# EasyEDA Pro project C51课程设计.eprj

# Schematic C51课程设计原理图
Create Date: 2022-09-08; Page Name: P1; Project Name: C51课程设计; Schematic Name: C51课程设计原理图; Update Date: 2022-09-14; Company: 亿航创客
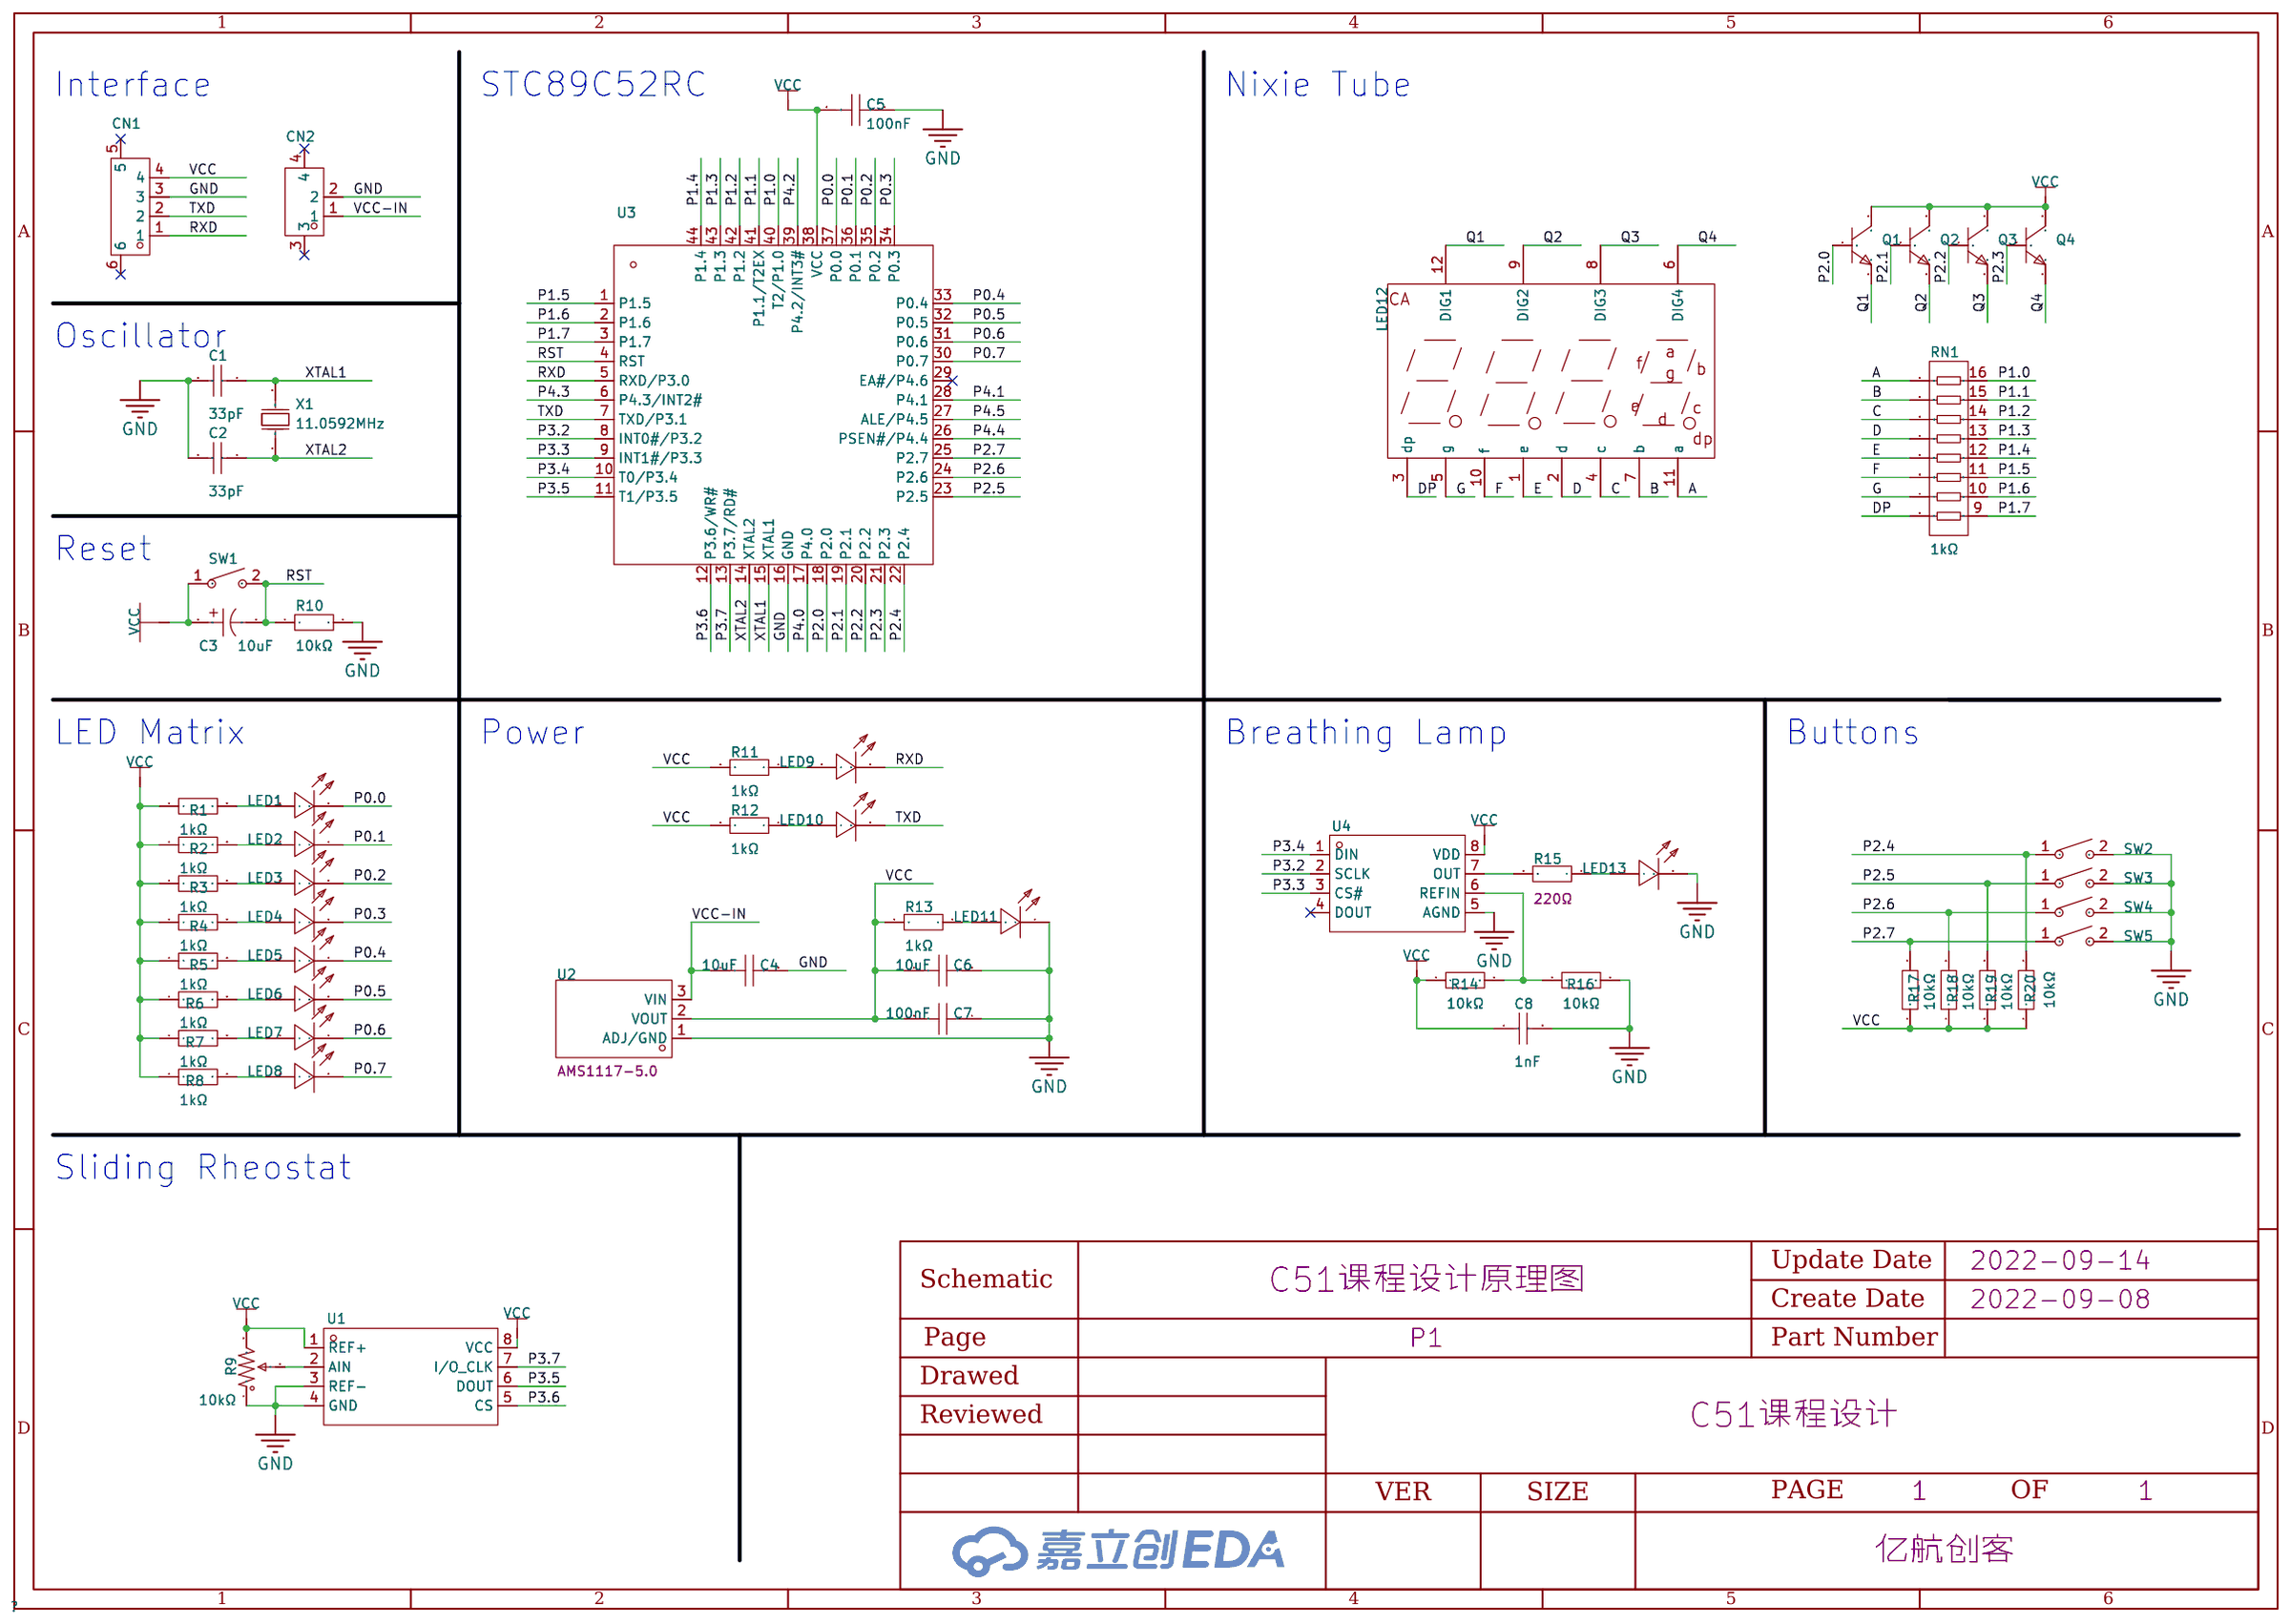
[diagram p0: schematic sheet]

## Parts
C1  33pF  [C0402]
C2  33pF  [C0402]
C3  10uF  [CAP-SMD_L2.0-W1.3-FD]
C4  10uF  [C0402]
C5  100nF  [C0402]
C6  10uF  [C0402]
C7  100nF  [C0402]
C8  1nF  [C0402]
CN1  -  [CONN-SMD_4P-P1.00_HDGC_HDGC1002WR-S-4P]
CN2  -  [CONN-SMD_HC-1.0-2PWT]
LED1  -  [LED0402-RD]
LED2  -  [LED0402-RD]
LED3  -  [LED0402-RD]
LED4  -  [LED0402-RD]
LED5  -  [LED0402-RD]
LED6  -  [LED0402-RD]
LED7  -  [LED0402-RD]
LED8  -  [LED0402-RD]
LED9  -  [LED0402-RD]
LED10  -  [LED0402-RD]
LED11  -  [LED0402-RD]
LED12  FJ2481BH  [LED-SEG-TH_FJ2481BH]
LED13  -  [LED0402-RD]
Q1  SS8050W Y1  [SOT-323-3_L2.1-W1.3-P1.30-LS2.3-BR]
Q2  SS8050W Y1  [SOT-323-3_L2.1-W1.3-P1.30-LS2.3-BR]
Q3  SS8050W Y1  [SOT-323-3_L2.1-W1.3-P1.30-LS2.3-BR]
Q4  SS8050W Y1  [SOT-323-3_L2.1-W1.3-P1.30-LS2.3-BR]
R1  1kΩ  [R0402]
R2  1kΩ  [R0402]
R3  1kΩ  [R0402]
R4  1kΩ  [R0402]
R5  1kΩ  [R0402]
R6  1kΩ  [R0402]
R7  1kΩ  [R0402]
R8  1kΩ  [R0402]
R9  10kΩ  [RES-ADJ-TH_3362P]
R10  10kΩ  [R0402]
R11  1kΩ  [R0402]
R12  1kΩ  [R0402]
R13  1kΩ  [R0402]
R14  10kΩ  [R0402]
R15  0402WGF2200TCE  [R0402]
R16  10kΩ  [R0402]
R17  10kΩ  [R0402]
R18  10kΩ  [R0402]
R19  10kΩ  [R0402]
R20  10kΩ  [R0402]
RN1  1kΩ  [RES-ARRAY-SMD_0603-16P-L4.0-W1.6-BL]
SW1  -  [SW-SMD_ST-1185S]
SW2  -  [SW-SMD_ST-1185S]
SW3  -  [SW-SMD_ST-1185S]
SW4  -  [SW-SMD_ST-1185S]
SW5  -  [SW-SMD_ST-1185S]
U1  XL549  [SOP-8_L5.0-W4.0-P1.27-LS6.0-BL]
U2  -  [SOT-89-3_L4.5-W2.5-P1.50-LS4.2-BR]
U3  STC89C52RC-40I  [LQFP-44_L10.0-W10.0-P0.80-LS12.0-BL]
U4  HGC5615CM/TR  [SOP-8_L4.9-W3.9-P1.27-LS6.0-BL-1]
X1  11.0592MHz  [OSC-SMD_L5.0-W3.2]

## Library data of the parts
C1 C2 = CC0402JRNPO9BN330: 容值:33pF;精度:±5%;额定电压:50V;材质(温度系数):NP0;; LCSC Part Name: 33pF ±5% 50V; Supplier Part: C1562; Manufacturer: YAGEO(国巨); Supplier Footprint: 0402; JLCPCB Part Class: Extended Part; Datasheet: https://atta.szlcsc.com/upload/public/pdf/source/20171026/C107005_15089856307561059550.pdf; Supplier: LCSC; Tolerance: ±5%; Voltage Rated: 50V; Temperature Coefficient: NP0
C3 = CA45-P-6.3V-10UF-K: 容值:10uF;精度:±10%;额定电压:6.3V;漏电流:-;纹波电流:-;等效串联电阻:-;工作温度:-;; LCSC Part Name: 10uF ±10% 6.3V; Supplier Part: C2844395; Manufacturer: CEC(振华新云); Supplier Footprint: CASE-P_2012; JLCPCB Part Class: Extended Part; Datasheet: https://atta.szlcsc.com/upload/public/pdf/source/20210702/C2844395_E7EBF1B65FEA8FC3CE954A9FCB08EE3D.pdf; Supplier: LCSC; Tolerance: ±10%; Rated Voltage: 6.3V
C4 C6 = ZRB15XR60J106ME12D: 容值:10uF;精度:±20%;额定电压:-;温度系数:-;; LCSC Part Name: 10uF ±20%; Supplier Part: C15525; Manufacturer: muRata(村田); Supplier Footprint: 0402; JLCPCB Part Class: Extended Part; Datasheet: https://atta.szlcsc.com/upload/public/pdf/source/20200716/C703695_F305F00487E4315D6560129E30A08821.pdf; Supplier: LCSC; Tolerance: ±20%
C5 = C1005X7R1H104KT000F: 容值:100nF;精度:±10%;额定电压:50V;材质(温度系数):X7R;; LCSC Part Name: 100nF ±10% 50V; Supplier Part: C1525; Manufacturer: TDK; Supplier Footprint: 0402; JLCPCB Part Class: Extended Part; Datasheet: https://atta.szlcsc.com/upload/public/pdf/source/20190306/C361198_777FA953A6F18EC27EDD92F6396B6F36.pdf; Supplier: LCSC; Tolerance: ±10%; Voltage Rated: 50V; Temperature Coefficient: X7R
C7 = C1005X7R1H104KT000F: 容值:100nF;精度:±10%;额定电压:50V;温度系数:X7R;; LCSC Part Name: 100nF ±10% 50V; Supplier Part: C1525; Manufacturer: TDK; Supplier Footprint: 0402; JLCPCB Part Class: Extended Part; Datasheet: https://atta.szlcsc.com/upload/public/pdf/source/20190306/C361198_777FA953A6F18EC27EDD92F6396B6F36.pdf; Supplier: LCSC; Tolerance: ±10%; Voltage Rated: 50V; Temperature Coefficient: X7R
C8 = 0402B102K500NT: 温度系数:X7R;容值:1nF;精度:±10%;额定电压:50V;; LCSC Part Name: 1nF(102) ±10% 50V; Supplier Part: C1523; Manufacturer: FH(风华); Supplier Footprint: 0402; JLCPCB Part Class: Basic Part; Datasheet: https://atta.szlcsc.com/upload/public/pdf/source/20170923/C1523_1506149254821988331.pdf; Supplier: LCSC; Temperature Coefficient: X7R; Tolerance: ±10%; Voltage Rated: 50V
CN1 = HDGC1002WR-S-4P: 参考系列:-;间距:1mm;插针结构:1x4P;排数:1;每排PIN数:4;行距:-;公母:公型插针;安装方式:卧贴;额定电流:1A;工作温度范围:-25~+70;; LCSC Part Name: SH1.0针座卧贴 4P; Supplier Part: C2936214; Manufacturer: HDGC(华德共创); Supplier Footprint: SMD,P=1mm; JLCPCB Part Class: Extended Part; Datasheet: https://atta.szlcsc.com/upload/public/pdf/source/20211229/E8A09E85670B5E97244D2008A24D97FE.pdf; Supplier: LCSC; Pitch: 1mm; Pins Structure: 1x4P; Number of Rows: 1; Number of PINs Per Row: 4; Gender: 公型插针; Mounting Style: 卧贴; Current Rating (Max): 1A; Operating Temperature Range: -25~+70
CN2 = HC-1.0-2PWT: 参考系列:-;间距:1mm;插针结构:1x2P;排数:1;每排PIN数:2;行距:-;公母:公型插针;安装方式:卧贴;额定电流:500mA;工作温度范围:-25~+85;; LCSC Part Name: 2P 卧贴 间距P=1mm; Supplier Part: C2845361; Manufacturer: HCTL(华灿天禄); Supplier Footprint: SMD,P=1mm; JLCPCB Part Class: Extended Part; Datasheet: https://atta.szlcsc.com/upload/public/pdf/source/20210728/C2845361_0889FB3BF4A487DD260A3CF291B63D1A.pdf; Supplier: LCSC; Pitch: 1mm; Pins Structure: 1x2P; Number of Rows: 1; Number of PINs Per Row: 2; Gender: 公型插针; Mounting Style: 卧贴; Current Rating (Max): 500mA; Operating Temperature Range: -25~+85
LED1-LED11 LED13 = NCD0402G1: 发光颜色:翠绿;; LCSC Part Name: 翠绿; Supplier Part: C130723; Manufacturer: 国星光电; Supplier Footprint: 0402; JLCPCB Part Class: Extended Part; Datasheet: https://atta.szlcsc.com/upload/public/pdf/source/20200820/C130723_D39B4171A1B8D8D2F39C1DC521C0922A.pdf; Supplier: LCSC; Emitted Color: 翠绿
LED12 = FJ2481BH: 数码管位数:4;数码管的显示尺寸:0.28''(7.11mm);电路连线类型:阳极(正极);照明颜色:红色;; LCSC Part Name: 四位0.28英寸红色共阳数码管 中间时钟两点不亮; Supplier Part: C10710; Manufacturer: 志浩; Supplier Footprint: 插件; JLCPCB Part Class: Extended Part; Datasheet: https://atta.szlcsc.com/upload/public/pdf/source/20200428/C10707_BF5216F237B56A64392E2674E7FC2A50.pdf; Supplier: LCSC; Number of Characters: 4; Digit/Alpha Size: 0.28''(7.11mm); Common Pin: 阳极(正极); Illumination Color: 红色
Q1-Q4 = SS8050W Y1: 晶体管类型:-;集射极击穿电压(Vceo):-;集电极电流(Ic):-;功率(Pd):-;集电极截止电流(Icbo):-;集电极-发射极饱和电压(VCE(sat)@Ic,Ib):-;直流电流增益(hFE@Ic,Vce):-;特征频率(fT):-;; LCSC Part Name: SS8050W Y1(Y1表示丝印) Y1(Y1表示丝印); Supplier Part: C2836073; Manufacturer: CBI(创基); Supplier Footprint: SOT-323; JLCPCB Part Class: Extended Part; Datasheet: https://atta.szlcsc.com/upload/public/pdf/source/20210603/C2836073_5EFBD6CEC895A378A6EEE893C4C8D798.pdf; Supplier: LCSC
R1-R8 = WR04X1002FTL: 阻值:10kΩ;精度:±1%;功率:1/16W;温度系数:±100ppm/;最大工作电压:50V;工作温度范围:-55~+155;; LCSC Part Name: 10kΩ ±1% 1/16W; Supplier Part: C11702; Manufacturer: 华新科(Walsin); Supplier Footprint: 0402; JLCPCB Part Class: Extended Part; Datasheet: https://atta.szlcsc.com/upload/public/pdf/source/20180228/C163810_15198053310761377184.pdf; Supplier: LCSC; Tolerance: ±1%; Power(Watts): 1/16W; Temperature Coefficient: ±100ppm/; Overload Voltage (Max): 50V; Operating Temperature Range: -55~+155
R9 = 3362P-1-103: 阻值:10kΩ;精度:±10%;温度系数:±250ppm/;; LCSC Part Name: 10kΩ ±10%; Supplier Part: C118956; Manufacturer: BOCHEN(博晨); Supplier Footprint: 插件; JLCPCB Part Class: Extended Part; Datasheet: https://atta.szlcsc.com/upload/public/pdf/source/20171114/C118956_15106326650691117445.pdf; Supplier: LCSC; Tolerance: ±10%; Temperature Coefficient: ±250ppm/
R10 R14 R16-R20 = WR04X1002FTL: 阻值:10kΩ;精度:±1%;功率:1/16W;温度系数:±100ppm/;最大工作电压:50V;工作温度范围:-55~+155;; LCSC Part Name: 10kΩ ±1% 1/16W; Supplier Part: C25744; Manufacturer: 华新科(Walsin); Supplier Footprint: 0402; JLCPCB Part Class: Extended Part; Datasheet: https://atta.szlcsc.com/upload/public/pdf/source/20180228/C163810_15198053310761377184.pdf; Supplier: LCSC; Tolerance: ±1%; Power(Watts): 1/16W; Temperature Coefficient: ±100ppm/; Overload Voltage (Max): 50V; Operating Temperature Range: -55~+155
R11-R13 = 0402WGF1001TCE: 电阻类型:厚膜电阻;阻值:1kΩ;精度:±1%;功率:62.5mW;温度系数:±100ppm/;最大工作电压:50V;工作温度范围:-55~+155;; LCSC Part Name: 1kΩ ±1% 62.5mW; Supplier Part: C11702; Manufacturer: UNI-ROYAL(厚声); Supplier Footprint: 0402; JLCPCB Part Class: Basic Part; Datasheet: https://atta.szlcsc.com/upload/public/pdf/source/20200306/C422600_1E6D84923E4A46A82E41ADD87F860B5C.pdf; Supplier: LCSC; Type: 厚膜电阻; Tolerance: ±1%; Power(Watts): 62.5mW; Temperature Coefficient: ±100ppm/; Overload Voltage (Max): 50V; Operating Temperature Range: -55~+155
R15 = 0402WGF2200TCE: LCSC Part Name: 220Ω; Supplier Part: C25091; Manufacturer: UNI-ROYAL(厚声); Supplier Footprint: 0402; JLCPCB Part Class: Basic Part; Datasheet: https://atta.szlcsc.com/upload/public/pdf/source/20170920/C25091_1505901205569982722.pdf; Supplier: LCSC
RN1 = 16P8WGJ0102T4E: 阻值:1kΩ;单个元件功率:62.5mW;电阻器数:8;引脚数:16;; LCSC Part Name: 1kΩ ±5%; Supplier Part: C422177; Manufacturer: UNI-ROYAL(厚声); Supplier Footprint: 0402x8; JLCPCB Part Class: Extended Part; Datasheet: https://atta.szlcsc.com/upload/public/pdf/source/20190903/C422177_4A1385B370B968DD1DEA88DDAAC32B2E.pdf; Supplier: LCSC; Power(Watts): 62.5mW; Number of Resistors: 8; Number of Pins: 16
SW1-SW5 = ST-1185S: 触点电流:50mA;额定电压(DC):12V;绝缘电阻:100MΩ;电路结构:单刀单掷;安装方式:立贴;按钮形状:圆形按钮;按钮/盖帽颜色:黑色;机械寿命:100000;工作温度:-20~+70;引脚样式:SMD接片;开关长度:4mm;开关宽度:3mm;开关高度:2mm;带支架:否;; LCSC Part Name: 轻触开关正按小龟; Supplier Part: C589191; Manufacturer: RISHENG(日昇); Supplier Footprint: SMD; JLCPCB Part Class: Extended Part; Datasheet: https://atta.szlcsc.com/upload/public/pdf/source/20200922/C589191_E74F821EA1C61BCC16EBC99CF1D66EDD.pdf; Supplier: LCSC; Contact Current: 50mA; Voltage Rating (DC): 12V; Insulation Resistance: 100MΩ; Circuit: 单刀单掷; Mounting Style: 立贴; Actuator Style: 圆形按钮; Actuator/Cap Color: 黑色; Mechanical Life: 100000; Operating Temperature: -20~+70; Pin Style: SMD接片; Switch Length: 4mm; Switch Width: 3mm; Switch Height: 2mm; Strike Gundam: 否
U1 = XL549: LCSC Part Name: 模数转换器; Supplier Part: C707062; Manufacturer: XINLUDA(信路达); Supplier Footprint: SOP-8; JLCPCB Part Class: Extended Part; Datasheet: https://atta.szlcsc.com/upload/public/pdf/source/20200724/C707062_2C933782E47D56A7CB471B5A539BA73B.pdf; Supplier: LCSC
U2 = AMS1117-5.0: 输出类型:-;; LCSC Part Name: AMS1117-5.0 SOT-89; Supplier Part: C2718490; Manufacturer: JSMSEMI(杰盛微); Supplier Footprint: SOT-89; JLCPCB Part Class: Extended Part; Datasheet: https://atta.szlcsc.com/upload/public/pdf/source/20211201/578FEEF9766904D398893791CE3EC879.pdf; Supplier: LCSC
U3 = STC89C52RC-40I: 工作电压:3.3V ~ 5.5V;CPU内核:8051;主频（MAX):80MHz;; Supplier Part: C8707; Manufacturer: STC(宏晶); Supplier Footprint: LQFP-44_10x10x08P; JLCPCB Part Class: Extended Part; Datasheet: https://atta.szlcsc.com/upload/public/pdf/source/20120807/1457706521177.pdf; Supplier: LCSC; Voltage - Supply (Vcc/Vdd): 3.3V ~ 5.5V; EEPROM Size: 4KB; Core Processor: 8051; Program Memory Size: 8KB; RAM Size: 512Bytes; Speed: 80MHz; Number of I/O: 39
U4 = HGC5615CM/TR: 趋稳时间为 12.5us 并具备上电复位功能的 10 位、单通道、低功耗 DAC; LCSC Part Name: 数模转换芯片DAC; Supplier Part: C2926359; Manufacturer: HGSEMI(华冠); Supplier Footprint: SOP-8; JLCPCB Part Class: Extended Part; Datasheet: https://atta.szlcsc.com/upload/public/pdf/source/20220425/B3CEFC1F100B44CAB54AB190A678D2D8.pdf; Supplier: LCSC
X1 = X5032110592MSB2GI: 晶振类型:贴片无源晶振;频率:11.0592MHz;频率公差:±10ppm;频率稳定度:±50ppm;负载电容:20pF;工作温度:-40~+85;; LCSC Part Name: 11.0592MHz ±10ppm 20pF; Supplier Part: C112574; Manufacturer: YXC扬兴科技; Supplier Footprint: SMD5032-2P; JLCPCB Part Class: Basic Part; Datasheet: https://atta.szlcsc.com/upload/public/pdf/source/20210329/C112559_847D3CACBA33ACCEB57DEA3AEBB187A1.pdf; Supplier: LCSC; Crystal Type: 贴片无源晶振; Frequency Tolerance: ±10ppm; Frequency Stability: ±50ppm; Load Capacitance: 20pF; Operating Temperature: -40~+85

## Nets
GND: C1.1 C2.1 C4.2 C5.1 C6.2 C7.1 C8.2 CN1.3 CN2.2 LED11.1(K) LED13.1(K) R9.1 R10.2 R16.2 SW2.2 SW3.2 SW4.2 SW5.2 U1.3(REF-) U1.4(GND) U2.1(ADJ/GND) U3.16(GND) U4.5(AGND)
VCC: C3.1 C5.2 C6.1 C7.2 C8.1 CN1.4 Q1.3(C) Q2.3(C) Q3.3(C) Q4.3(C) R1.1 R2.1 R3.1 R4.1 R5.1 R6.1 R7.1 R8.1 R9.3 R11.2 R12.2 R13.2 R14.1 R17.1 R18.1 R19.1 R20.1 SW1.1 U1.1(REF+) U1.8(VCC) U2.2(VOUT) U3.38(VCC) U4.8(VDD)
VCC-IN: C4.1 CN2.1 U2.3(VIN)
A: LED12.11(a) RN1.1
B: LED12.7(b) RN1.2
C: LED12.4(c) RN1.3
D: LED12.2(d) RN1.4
DP: LED12.3(dp) RN1.8
E: LED12.1(e) RN1.5
F: LED12.10(f) RN1.6
G: LED12.5(g) RN1.7
P0.0: LED1.1(K) U3.37(P0.0)
P0.1: LED2.1(K) U3.36(P0.1)
P0.2: LED3.1(K) U3.35(P0.2)
P0.3: LED4.1(K) U3.34(P0.3)
P0.4: LED5.1(K) U3.33(P0.4)
P0.5: LED6.1(K) U3.32(P0.5)
P0.6: LED7.1(K) U3.31(P0.6)
P0.7: LED8.1(K) U3.30(P0.7)
P1.0: RN1.16 U3.40(T2/P1.0)
P1.1: RN1.15 U3.41(P1.1/T2EX)
P1.2: RN1.14 U3.42(P1.2)
P1.3: RN1.13 U3.43(P1.3)
P1.4: RN1.12 U3.44(P1.4)
P1.5: RN1.11 U3.1(P1.5)
P1.6: RN1.10 U3.2(P1.6)
P1.7: RN1.9 U3.3(P1.7)
P2.0: Q1.1(B) U3.18(P2.0)
P2.1: Q2.1(B) U3.19(P2.1)
P2.2: Q3.1(B) U3.20(P2.2)
P2.3: Q4.1(B) U3.21(P2.3)
P2.4: R20.2 SW2.1 U3.22(P2.4)
P2.5: R19.2 SW3.1 U3.23(P2.5)
P2.6: R18.2 SW4.1 U3.24(P2.6)
P2.7: R17.2 SW5.1 U3.25(P2.7)
P3.2: U3.8(INT0#/P3.2) U4.2(SCLK)
P3.3: U3.9(INT1#/P3.3) U4.3(CS#)
P3.4: U3.10(T0/P3.4) U4.1(DIN)
P3.5: U1.6(DOUT) U3.11(T1/P3.5)
P3.6: U1.5(CS) U3.12(P3.6/WR#)
P3.7: U1.7(I/O_CLK) U3.13(P3.7/RD#)
P4.0: U3.17(P4.0)
P4.1: U3.28(P4.1)
P4.2: U3.39(P4.2/INT3#)
P4.3: U3.6(P4.3/INT2#)
P4.4: U3.26(PSEN#/P4.4)
P4.5: U3.27(ALE/P4.5)
Q1: LED12.12(DIG1) Q1.2(E)
Q2: LED12.9(DIG2) Q2.2(E)
Q3: LED12.8(DIG3) Q3.2(E)
Q4: LED12.6(DIG4) Q4.2(E)
RST: C3.2 R10.1 SW1.2 U3.4(RST)
RXD: CN1.1 LED9.1(K) U3.5(RXD/P3.0)
TXD: CN1.2 LED10.1(K) U3.7(TXD/P3.1)
XTAL1: C1.2 U3.15(XTAL1) X1.2(OSC2)
XTAL2: C2.2 U3.14(XTAL2) X1.1(OSC1)
$1N4455: LED1.2(A) R1.2
$1N4484: LED2.2(A) R2.2
$1N4513: LED3.2(A) R3.2
$1N4542: LED4.2(A) R4.2
$1N4585: LED5.2(A) R5.2
$1N4614: LED6.2(A) R6.2
$1N4643: LED7.2(A) R7.2
$1N4672: LED8.2(A) R8.2
$1N12130: LED13.2(A) R15.1
$1N12199: R15.2 U4.7(OUT)
$1N12610: R14.2 R16.1 U4.6(REFIN)
$1N15924: R9.2 U1.2(AIN)
$1N38750: LED11.2(A) R13.1
$1N39455: LED9.2(A) R11.1
$1N39651: LED10.2(A) R12.1

Not connected (* = marked no-connect by the designer): CN1 5* 6*; CN2 3* 4*; U3 29(EA#/P4.6)*; U4 4(DOUT)*

## Notes on the sheet
- Interface
- STC89C52RC
- Nixie Tube
- Oscillator
- Reset
- LED Matrix
- Power
- Breathing Lamp
- Buttons
- Sliding Rheostat

# Board PCB1
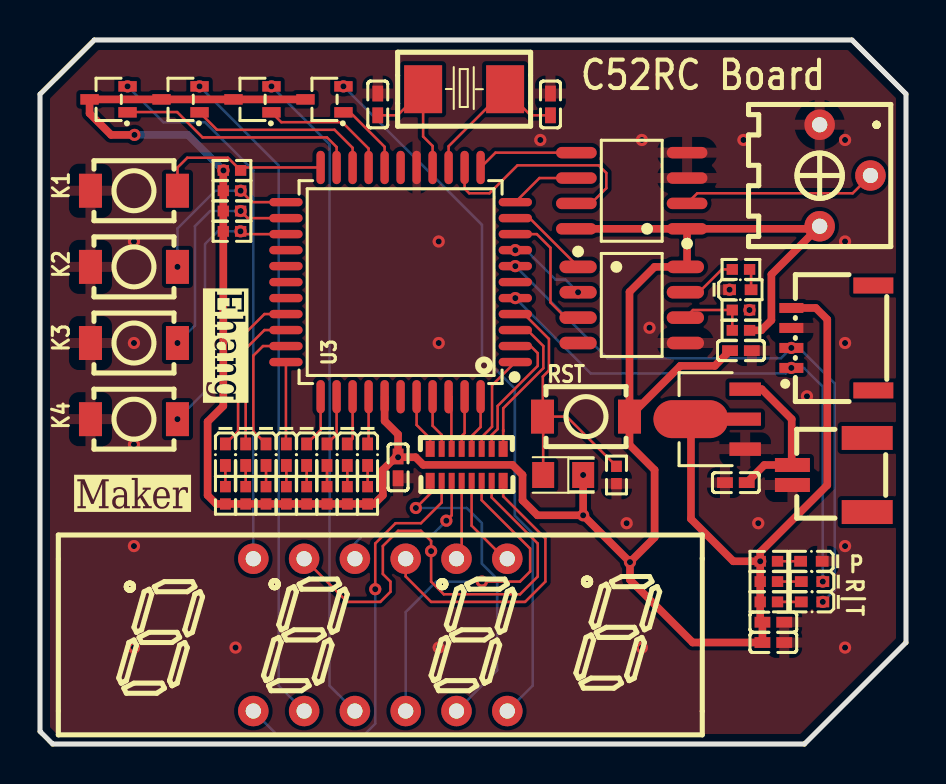
[diagram p1: board, top side]
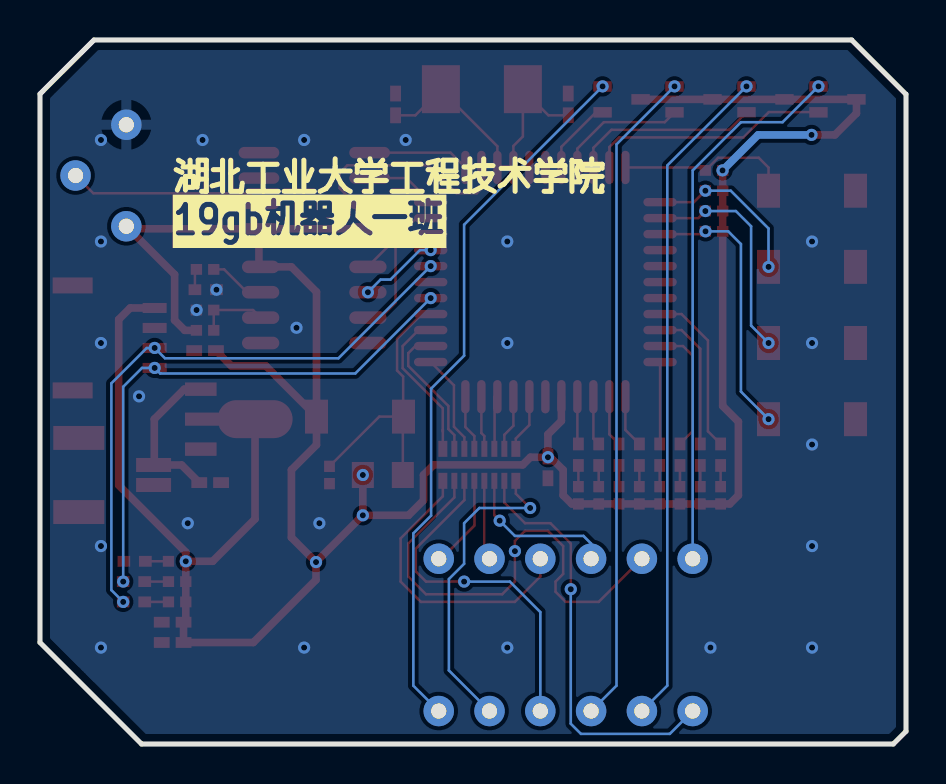
[diagram p2: board, bottom side, seen from below]

Outline 43.31 x 35.23 mm; copper layers: Top Layer, Bottom Layer. Coordinates in mm from the lower left corner of the outline.
Outline path: 0,32.51 0,0.64 0.64,0 38.23,0 43.31,5.08 43.31,32.53 40.6,35.23 2.72,35.23 0,32.51
Stack: Top Layer 0.035mm / Dielectric1 1.51mm FR4 er 4.5 / Bottom Layer 0.035mm

## Design rules (mm)
net GND: GND
net VCC: Power
net VCC-IN: Power
spacing safeClearance (default): track to track 0.152, other pairs 0.152 to 0.3
track width trackWidth (default): min 0.127, default 0.127, max 2.54
track width Power: min 0.254, default 0.381, max 2.54
differential pair differentialPair (default): width min 0.127, default 0.254, max 2.54; gap min 0.152, default 0.152
via viaSize (default): diameter min 0.5, default 0.61, max 10; hole min 0.3, default 0.305, max 6
net class Power uses Power
net VCC uses Power
net VCC-IN uses Power

## Placement (name value [footprint] x y rotation side)
C1  33pF  [C0402]  16.89 32 270 top
C2  33pF  [C0402]  25.53 32 270 top
C3  10uF  [CAP-SMD_L2.0-W1.3-FD]  26.16 13.46 180 top
C4  10uF  [C0402]  34.8 13.08 180 top
C5  100nF  [C0402]  17.91 13.84 90 top
C6  10uF  [C0402]  36.67 6.1 0 top
C7  100nF  [C0402]  36.67 5.08 180 top
C8  1nF  [C0402]  35.05 19.69 0 top
CN1  -  [CONN-SMD_4P-P1.00_HDGC_HDGC1002WR-S-4P]  39.62 20.32 90 top
CN2  -  [CONN-SMD_HC-1.0-2PWT]  39.5 13.46 90 top
LED1  -  [LED0402-RD]  16.38 14.48 270 top
LED2  -  [LED0402-RD]  15.37 14.48 270 top
LED3  -  [LED0402-RD]  14.35 14.48 270 top
LED4  -  [LED0402-RD]  13.33 14.48 270 top
LED5  -  [LED0402-RD]  12.32 14.48 270 top
LED6  -  [LED0402-RD]  11.3 14.48 270 top
LED7  -  [LED0402-RD]  10.29 14.48 270 top
LED8  -  [LED0402-RD]  9.27 14.48 270 top
LED9  -  [LED0402-RD]  38.61 8.13 180 top
LED10  -  [LED0402-RD]  38.61 7.11 180 top
LED11  -  [LED0402-RD]  38.58 9.14 180 top
LED12  FJ2481BH  [LED-SEG-TH_FJ2481BH]  17.02 5.46 180 top
LED13  -  [LED0402-RD]  35.02 22.73 0 top
Q1  SS8050W Y1  [SOT-323-3_L2.1-W1.3-P1.30-LS2.3-BR]  14.22 32.26 0 top
Q2  SS8050W Y1  [SOT-323-3_L2.1-W1.3-P1.30-LS2.3-BR]  10.63 32.26 0 top
Q3  SS8050W Y1  [SOT-323-3_L2.1-W1.3-P1.30-LS2.3-BR]  7.03 32.26 0 top
Q4  SS8050W Y1  [SOT-323-3_L2.1-W1.3-P1.30-LS2.3-BR]  3.43 32.26 0 top
R1  1kΩ  [R0402]  16.38 12.45 90 top
R2  1kΩ  [R0402]  15.37 12.45 90 top
R3  1kΩ  [R0402]  14.35 12.45 90 top
R4  1kΩ  [R0402]  13.34 12.45 90 top
R5  1kΩ  [R0402]  12.32 12.45 90 top
R6  1kΩ  [R0402]  11.3 12.45 90 top
R7  1kΩ  [R0402]  10.29 12.45 90 top
R8  1kΩ  [R0402]  9.27 12.45 90 top
R9  10kΩ  [RES-ADJ-TH_3362P]  40.26 28.45 270 top
R10  10kΩ  [R0402]  28.83 13.46 270 top
R11  1kΩ  [R0402]  36.45 8.13 180 top
R12  1kΩ  [R0402]  36.45 7.11 180 top
R13  1kΩ  [R0402]  36.45 9.14 180 top
R14  10kΩ  [R0402]  35.05 20.7 180 top
R15  0402WGF2200TCE  [R0402]  35.05 23.75 180 top
R16  10kΩ  [R0402]  35.05 21.72 0 top
R17  10kΩ  [R0402]  9.6 25.65 0 top
R18  10kΩ  [R0402]  9.6 26.67 0 top
R19  10kΩ  [R0402]  9.6 27.69 0 top
R20  10kΩ  [R0402]  9.6 28.7 0 top
RN1  1kΩ  [RES-ARRAY-SMD_0603-16P-L4.0-W1.6-BL]  21.34 13.97 0 top
SW1  -  [SW-SMD_ST-1185S]  27.31 16.38 180 top
SW2  -  [SW-SMD_ST-1185S]  4.7 27.69 180 top
SW3  -  [SW-SMD_ST-1185S]  4.7 23.88 180 top
SW4  -  [SW-SMD_ST-1185S]  4.7 20.07 180 top
SW5  -  [SW-SMD_ST-1185S]  4.7 16.26 180 top
U1  XL549  [SOP-8_L5.0-W4.0-P1.27-LS6.0-BL]  29.59 27.69 90 top
U2  -  [SOT-89-3_L4.5-W2.5-P1.50-LS4.2-BR]  33.91 16.26 0 top
U3  STC89C52RC-40I  [LQFP-44_L10.0-W10.0-P0.80-LS12.0-BL]  18.03 23.11 90 top
U4  HGC5615CM/TR  [SOP-8_L4.9-W3.9-P1.27-LS6.0-BL-1]  29.59 21.97 270 top
X1  11.0592MHz  [OSC-SMD_L5.0-W3.2]  21.21 32.77 180 top

## Footprints (pads in the part's own frame, mm; a bottom-side part is the same pattern mirrored in y, then rotated)
C0402
  rect 0.79x0.54 smd: 1(-0.545,0) 2(0.545,0)
CAP-SMD_L2.0-W1.3-FD
  rect 1.1x1.3 smd: 1(-1,0) 2(1,0)
CONN-SMD_4P-P1.00_HDGC_HDGC1002WR-S-4P
  rect 0.5x1.2 smd: 1(-1.5,2.05) 2(-0.5,2.05) 3(0.5,2.05) 4(1.5,2.05)
  rect 0.8x2 smd: 5(2.625,-2.05) 6(-2.625,-2.05)
CONN-SMD_HC-1.0-2PWT
  rect 0.701x1.75 smd: 1(0.5,1.869) 2(-0.5,1.869)
  rect 1.199x2.55 smd: 3(-1.854,-1.869) 4(1.854,-1.869)
LED0402-RD
  rect 0.637x0.541 smd: 1(-0.538,0) 2(0.538,0)
LED-SEG-TH_FJ2481BH
  round 1.524 hole 0.762: 1(-6.35,-3.81) 2(-3.81,-3.81) 3(-1.27,-3.81) 4(1.27,-3.81) 5(3.81,-3.81) 6(6.35,-3.81) 7(6.35,3.81) 8(3.81,3.81) 9(1.27,3.81) 10(-1.27,3.81) 11(-3.81,3.81) 12(-6.35,3.81)
LQFP-44_L10.0-W10.0-P0.80-LS12.0-BL
  oval 0.419x1.669 smd: 1(-4,-5.736) 2(-3.2,-5.736) 3(-2.401,-5.736) 4(-1.6,-5.736) 5(-0.8,-5.736) 6(0,-5.736) 7(0.8,-5.736) 8(1.6,-5.736) 9(2.401,-5.736) 10(3.2,-5.736) 11(4,-5.736) 23(4,5.736) 24(3.2,5.736) 25(2.401,5.736) 26(1.6,5.736) 27(0.8,5.736) 28(0,5.736) 29(-0.8,5.736) 30(-1.6,5.736) 31(-2.401,5.736) 32(-3.2,5.736) 33(-4,5.736)
  oval 1.669x0.419 smd: 12(5.736,-4) 13(5.736,-3.2) 14(5.736,-2.401) 15(5.736,-1.6) 16(5.736,-0.8) 17(5.736,0) 18(5.736,0.8) 19(5.736,1.6) 20(5.736,2.401) 21(5.736,3.2) 22(5.736,4) 34(-5.736,4) 35(-5.736,3.2) 36(-5.736,2.401) 37(-5.736,1.6) 38(-5.736,0.8) 39(-5.736,0) 40(-5.736,-0.8) 41(-5.736,-1.6) 42(-5.736,-2.401) 43(-5.736,-3.2) 44(-5.736,-4)
OSC-SMD_L5.0-W3.2
  rect 1.9x2.4 smd: 1(-2.05,0) 2(2.05,0)
R0402
  rect 0.566x0.54 smd: 1(-0.433,0) 2(0.433,0)
RES-ADJ-TH_3362P
  round 1.524 hole 0.762: 1(-2.54,-1.27) 2(0,1.27) 3(2.54,-1.27)
RES-ARRAY-SMD_0603-16P-L4.0-W1.6-BL
  rect 0.45x0.8 smd: 1(-1.825,-0.8) 8(1.825,-0.8) 9(1.825,0.8) 16(-1.825,0.8)
  rect 0.3x0.8 smd: 2(-1.25,-0.8) 3(-0.75,-0.8) 4(-0.25,-0.8) 5(0.25,-0.8) 6(0.75,-0.8) 7(1.25,-0.8) 10(1.25,0.8) 11(0.75,0.8) 12(0.25,0.8) 13(-0.25,0.8) 14(-0.75,0.8) 15(-1.25,0.8)
SOP-8_L4.9-W3.9-P1.27-LS6.0-BL-1
  oval 0.63x1.865 smd: 1(-1.905,-2.683) 2(-0.635,-2.683) 3(0.635,-2.683) 4(1.905,-2.683) 5(1.905,2.683) 6(0.635,2.683) 7(-0.635,2.683) 8(-1.905,2.683)
SOP-8_L5.0-W4.0-P1.27-LS6.0-BL
  oval 0.574x2.035 smd: 1(-1.905,-2.768) 2(-0.635,-2.768) 3(0.635,-2.768) 4(1.905,-2.768) 5(1.905,2.768) 6(0.635,2.768) 7(-0.635,2.768) 8(-1.905,2.768)
SOT-89-3_L4.5-W2.5-P1.50-LS4.2-BR
  rect 1.575x0.672 smd: 1(1.356,-1.5) 3(1.356,1.5)
  custom 5.377x1.9 smd: 2(-1.356,0)
SOT-323-3_L2.1-W1.3-P1.30-LS2.3-BR
  rect 0.919x0.526 smd: 1(0.95,-0.65) 2(0.95,0.65) 3(-0.95,0)
SW-SMD_ST-1185S
  rect 1.15x1.7 smd: 1(-2.175,0) 2(2.175,0)

## Nets
As in the schematic.

Pads without a net: CN1 5 6; CN2 3 4; U3 29; U4 4

## Via types
v1: diameter 0.61, hole 0.305, Top Layer to Bottom Layer, 54 vias

## Routing (per net, layer and track width the routed paths; a pad name or vN(x,y) marks a point on that pad's centre or on a via; arc(x,y) is an arc through that point)
GND:
  vias: v1(4.7,25.15) v1(4.7,20.07) v1(4.7,14.99) v1(4.7,9.91) v1(4.7,4.83) v1(9.78,4.83) v1(19.94,25.15) v1(19.94,20.07) v1(19.94,4.83) v1(25.02,30.23) v1(29.34,11.05) v1(30.1,30.23) v1(30.1,4.83) v1(30.48,20.83) v1(34.48,22.73) v1(35.18,30.23) v1(35.48,21.72) v1(35.92,11.05) v1(38.35,17.4) v1(40.26,30.23) v1(40.26,25.15) v1(40.26,20.07) v1(40.26,9.91) v1(40.26,4.83)
VCC: length 150.2
  Top Layer w0.381: U1.8 U1.1 ; U1.1 38.86,25.78 ; U1.1 32.36,23.96 U4.8 30.73,23.88 29.48,22.62 SW1.1 ; v1(27.16,13.46) v1(27.16,11.45) ; v1(27.16,11.45) v1(29.5,9.1) ; v1(27.16,11.45) 24.88,11.45 24.13,12.19 24.13,13.46 23.62,13.97 19.16,13.97 18.78,14.35 v1(17.91,14.35) ; 38.86,25.78 R9.3 ; 38.86,25.78 36.58,23.5 36.58,21.21 36.07,20.7 R14.1 ; v1(36.02,9.14) 34.67,9.14 32.55,11.26 U2.2 ; v1(36.02,9.14) 36.02,9.6 39.37,12.95 39.37,21.25 38.8,21.82 CN1.4 ; v1(36.02,9.14) R11.2 R12.2 36.02,6.21 C6.1 C7.2 32.64,5.08 29.5,8.22 v1(29.5,9.1) ; v1(4.72,30.48) 3.56,30.48 2.48,31.56 Q4.3 Q3.3 Q2.3 Q1.3 ; v1(29.5,9.1) 30.73,10.33 30.73,13.72 29.48,14.97 SW1.1 ; SW1.1 32.02,18.92 33.75,18.92 34.51,19.69 ; U3.38 17.23,16.17 17.91,15.49 C5.2 17.82,14.39 17.15,13.72 17.15,12.45 16.71,12.01 R1.1 R2.1 R3.1 R4.1 R5.1 R6.1 R7.1 R8.1 8.81,12.01 8.38,12.45 8.38,16.13 9.17,16.91 9.17,28.7
  Bottom Layer w0.381: v1(4.72,30.48) 7.4,30.48 v1(9.18,28.7)
VCC-IN: length 7.9
  Top Layer w0.381: U2.3 36.09,17.76 37.59,16.26 37.59,14 CN2.1 36.22,13.96 C4.1
A: length 15.8
  Top Layer w0.127: v1(18.8,11.81) 19.51,12.53 RN1.1
  Bottom Layer w0.127: v1(18.8,11.81) 21.34,11.81 22.1,11.05 22.1,9.02 22.86,8.25 22.86,3.68 LED12.11
B: length 21.1
  Top Layer w0.127: RN1.2 20.09,12.09 19.05,11.05 17.78,11.05 16.76,10.03 v1(16.76,7.75)
  Bottom Layer w0.127: v1(16.76,7.75) 16.76,1.02 16.26,0.51 11.81,0.51 LED12.7
C: length 7.9
  Top Layer w0.127: v1(20.32,11.18) 20.59,11.44 RN1.3
  Bottom Layer w0.127: LED12.4 15.75,10.03 16.13,10.41 19.56,10.41 v1(20.32,11.18)
D: length 4
  Top Layer w0.127: LED12.2 21.09,9.53 RN1.4
DP: length 14.7
  Top Layer w0.127: RN1.8 23.16,12.4 25.27,10.29 25.27,8.13 24.26,7.11 19.56,7.11 18.29,8.38 LED12.3
E: length 4.7
  Top Layer w0.127: RN1.5 21.59,10.93 23.24,9.27 LED12.1
F: length 17.6
  Top Layer w0.127: RN1.6 22.09,12.2 24.51,9.78 24.51,8.64 24,8.13 v1(22.1,8.13)
  Bottom Layer w0.127: v1(22.1,8.13) 19.81,8.13 18.29,6.6 LED12.10
G: length 24.5
  Top Layer w0.127: LED12.5 15.37,7.11 17.02,7.11 17.53,7.62 17.53,8.13 17.15,8.51 17.15,9.91 17.91,10.67 19.05,10.67 19.56,10.16 v1(19.56,9.65) 19.56,8.13 20.19,7.49 24,7.49 24.89,8.38 24.89,10.03 22.59,12.34 RN1.7
P0.0: length 2.4
  Top Layer w0.127: LED1.1 16.43,15.07 U3.37
P0.1: length 2.5
  Top Layer w0.127: LED2.1 15.63,15.28 U3.36
P0.2: length 2.6
  Top Layer w0.127: LED3.1 14.83,15.5 U3.35
P0.3: length 2.7
  Top Layer w0.127: LED4.1 14.03,15.72 U3.34
P0.4: length 4.1
  Top Layer w0.127: U3.33 12.3,15.04 LED5.1
P0.5: length 6.5
  Top Layer w0.127: U3.32 11.15,19.91 10.67,19.43 10.67,15.65 LED6.1
P0.6: length 7.2
  Top Layer w0.127: LED7.1 10.29,19.78 11.22,20.71 U3.31
P0.7: length 8.4
  Top Layer w0.127: LED8.1 9.91,15.65 9.91,20.2 11.22,21.51 U3.30
P1.0: length 2.9
  Top Layer w0.127: U3.40 18.83,15.96 19.51,15.29 RN1.16
P1.1: length 2.8
  Top Layer w0.127: U3.41 19.63,15.93 20.09,15.47 RN1.15
P1.2: length 2.8
  Top Layer w0.127: RN1.14 20.57,14.78 20.57,17.38 U3.42
P1.3: length 2.7
  Top Layer w0.127: U3.43 21.23,15.56 21.09,15.41 RN1.13
P1.4: length 2.8
  Top Layer w0.127: U3.44 22.03,15.86 21.59,15.41 RN1.12
P1.5: length 5
  Top Layer w0.127: U3.1 22.61,17.95 22.61,15.88 22.09,15.35 RN1.11
P1.6: length 7
  Top Layer w0.127: U3.2 24.54,19.91 24.89,19.56 24.89,18.92 22.89,16.92 22.89,15.76 22.59,15.46 RN1.10
P1.7: length 7.9
  Top Layer w0.127: RN1.9 23.16,15.72 23.17,15.64 23.17,16.8 25.17,18.81 25.17,19.91 24.37,20.71 U3.3
P2.0: length 3.8
  Top Layer w0.127: U3.18 17.23,29.88 15.51,31.61 Q1.1
P2.1: length 6.6
  Top Layer w0.127: Q2.1 12.07,31.11 15.11,31.11 16.43,29.79 U3.19
P2.2: length 9.4
  Top Layer w0.127: Q3.1 8.85,30.73 14.73,30.73 15.63,29.83 U3.20
P2.3: length 12.2
  Top Layer w0.127: Q4.1 4.39,31.62 6.86,31.62 8.13,30.35 14.35,30.35 14.83,29.87 U3.21
P2.4: length 8.8
  Top Layer w0.127: U3.22 10.18,28.85 10.03,28.7 9.4,29.34 7.37,29.34 6.87,28.84 SW2.1
P2.5: length 8.4
  Top Layer w0.127: U3.23 10.6,27.11 v1(10.03,27.69)
  Bottom Layer w0.127: v1(6.87,23.88) 6.87,25.8 8.76,27.69 v1(10.03,27.69)
P2.6: length 11.2
  Top Layer w0.127: U3.24 10.39,26.31 v1(10.03,26.67)
  Bottom Layer w0.127: v1(6.87,20.07) 7.75,20.94 7.75,25.91 8.51,26.67 v1(10.03,26.67)
P2.7: length 13.7
  Top Layer w0.127: 10.03,25.65 10.17,25.51 U3.25
  Bottom Layer w0.127: v1(6.87,16.26) 8.25,17.64 8.25,25.02 8.89,25.65 v1(10.03,25.65)
P3.2: length 4
  Bottom Layer w0.127: v1(26.91,22.61) 26.27,23.24 25.78,23.24 24.31,24.71 v1(23.77,24.71)
P3.3: length 6.5
  Top Layer w0.127: U3.9 24.84,25.51 25.53,24.83 25.53,22.1 26.29,21.34 U4.3
P3.4: length 4.2
  Top Layer w0.127: U3.10 24.49,26.31 26.91,23.89 U4.1
P3.5: length 3.6
  Top Layer w0.127: U3.11 24.98,28.32 U1.6
P3.6: length 5.1
  Top Layer w0.127: U1.5 22.78,29.59 U3.12
P3.7: length 11.6
  Top Layer w0.127: U3.13 21.23,27.79 21.46,27.56 22.48,27.56 23.88,28.96 27.94,28.96 28.32,28.58 28.32,27.81 27.56,27.05 U1.7
Q1: length 35.7
  Bottom Layer w0.127: v1(15.17,32.91) 22.1,25.98 22.1,19.43 23.75,17.78 23.75,11.43 24.64,10.54 24.64,2.92 LED12.12
Q2: length 33
  Bottom Layer w0.127: v1(11.58,32.91) 14.48,30.01 14.48,2.92 LED12.9
Q3: length 33.4
  Bottom Layer w0.127: v1(7.98,32.91) 11.94,28.95 11.94,2.92 LED12.8
Q4: length 27.5
  Bottom Layer w0.127: LED12.6 10.67,28.7 8.25,31.11 6.17,31.11 v1(4.38,32.91)
RST: length 13.9
  Top Layer w0.127: R10.1 26.34,16.38 SW1.2 ; SW1.2 25.16,16.35 C3.2 ; SW1.2 25.15,16.4 25.15,18.39 25.45,18.69 25.45,20.27 24.21,21.51 U3.4
RXD: length 27.2
  Bottom Layer w0.127: v1(39.15,8.13) 39.15,17.88 38.2,18.82 v1(37.57,18.82) 37.3,18.54 27.54,18.54 v1(23.77,22.31)
TXD: length 30
  Bottom Layer w0.127: v1(23.77,23.91) 28.38,19.3 37.06,19.3 v1(37.57,19.82) 37.58,19.81 37.97,19.81 39.74,18.05 39.74,7.7 v1(39.15,7.11)
XTAL1: length 6.9
  Top Layer w0.127: U3.15 19.63,29.92 19.16,30.4 19.16,32.74 17.88,31.46 C1.2
XTAL2: length 7.9
  Top Layer w0.127: C2.2 24.54,31.46 23.26,32.74 20.43,29.91 U3.14
$1N4455: length 1.1
  Top Layer w0.127: LED1.2 R1.2
$1N4484: length 1.1
  Top Layer w0.127: 15.37,13.94 R2.2
$1N4513: length 1.1
  Top Layer w0.127: LED3.2 14.35,12.88
$1N4542: length 1.1
  Top Layer w0.127: LED4.2 R4.2
$1N4585: length 1.1
  Top Layer w0.127: LED5.2 R5.2
$1N4614: length 1.1
  Top Layer w0.127: 11.3,13.94 R6.2
$1N4643: length 1.1
  Top Layer w0.127: LED7.2 10.29,12.88
$1N4672: length 1.1
  Top Layer w0.127: LED8.2 9.27,12.88
$1N12130: length 1
  Top Layer w0.127: R15.1 35.56,23.67 LED13.2
$1N12199: length 2.8
  Top Layer w0.127: U4.7 32.95,22.61 34.09,23.75 34.62,23.75
$1N12610: length 3.5
  Top Layer w0.127: 34.62,20.7 34.62,21.72 32.65,21.72 U4.6
$1N15924: length 9.7
  Top Layer w0.127: R9.2 40.64,27.56 32.87,27.56 U1.2
$1N38750: length 1.2
  Top Layer w0.127: R13.1 LED11.2
$1N39455: length 1.2
  Top Layer w0.127: R11.1 LED9.2
$1N39651: length 1.2
  Top Layer w0.127: R12.1 LED10.2

## Copper pours and planes (outline as drawn; the poured copper is in the pictures)
GND on Top Layer: -0.38,35.69 43.56,35.69 43.56,-0.25 -0.38,-0.25
GND on Bottom Layer: -0.38,35.69 43.56,35.69 43.56,-0.25 -0.38,-0.25

## Text on the board
Bottom Silkscreen Layer: 湖北工业大学工程技术学院 | 19gb机器人一班
Top Silkscreen Layer: RST | K1 | K2 | K3 | K4 | R|T | P | C52RC Board | Maker | Ehang
